# EAGLE design duo (EAGLE 5.06)
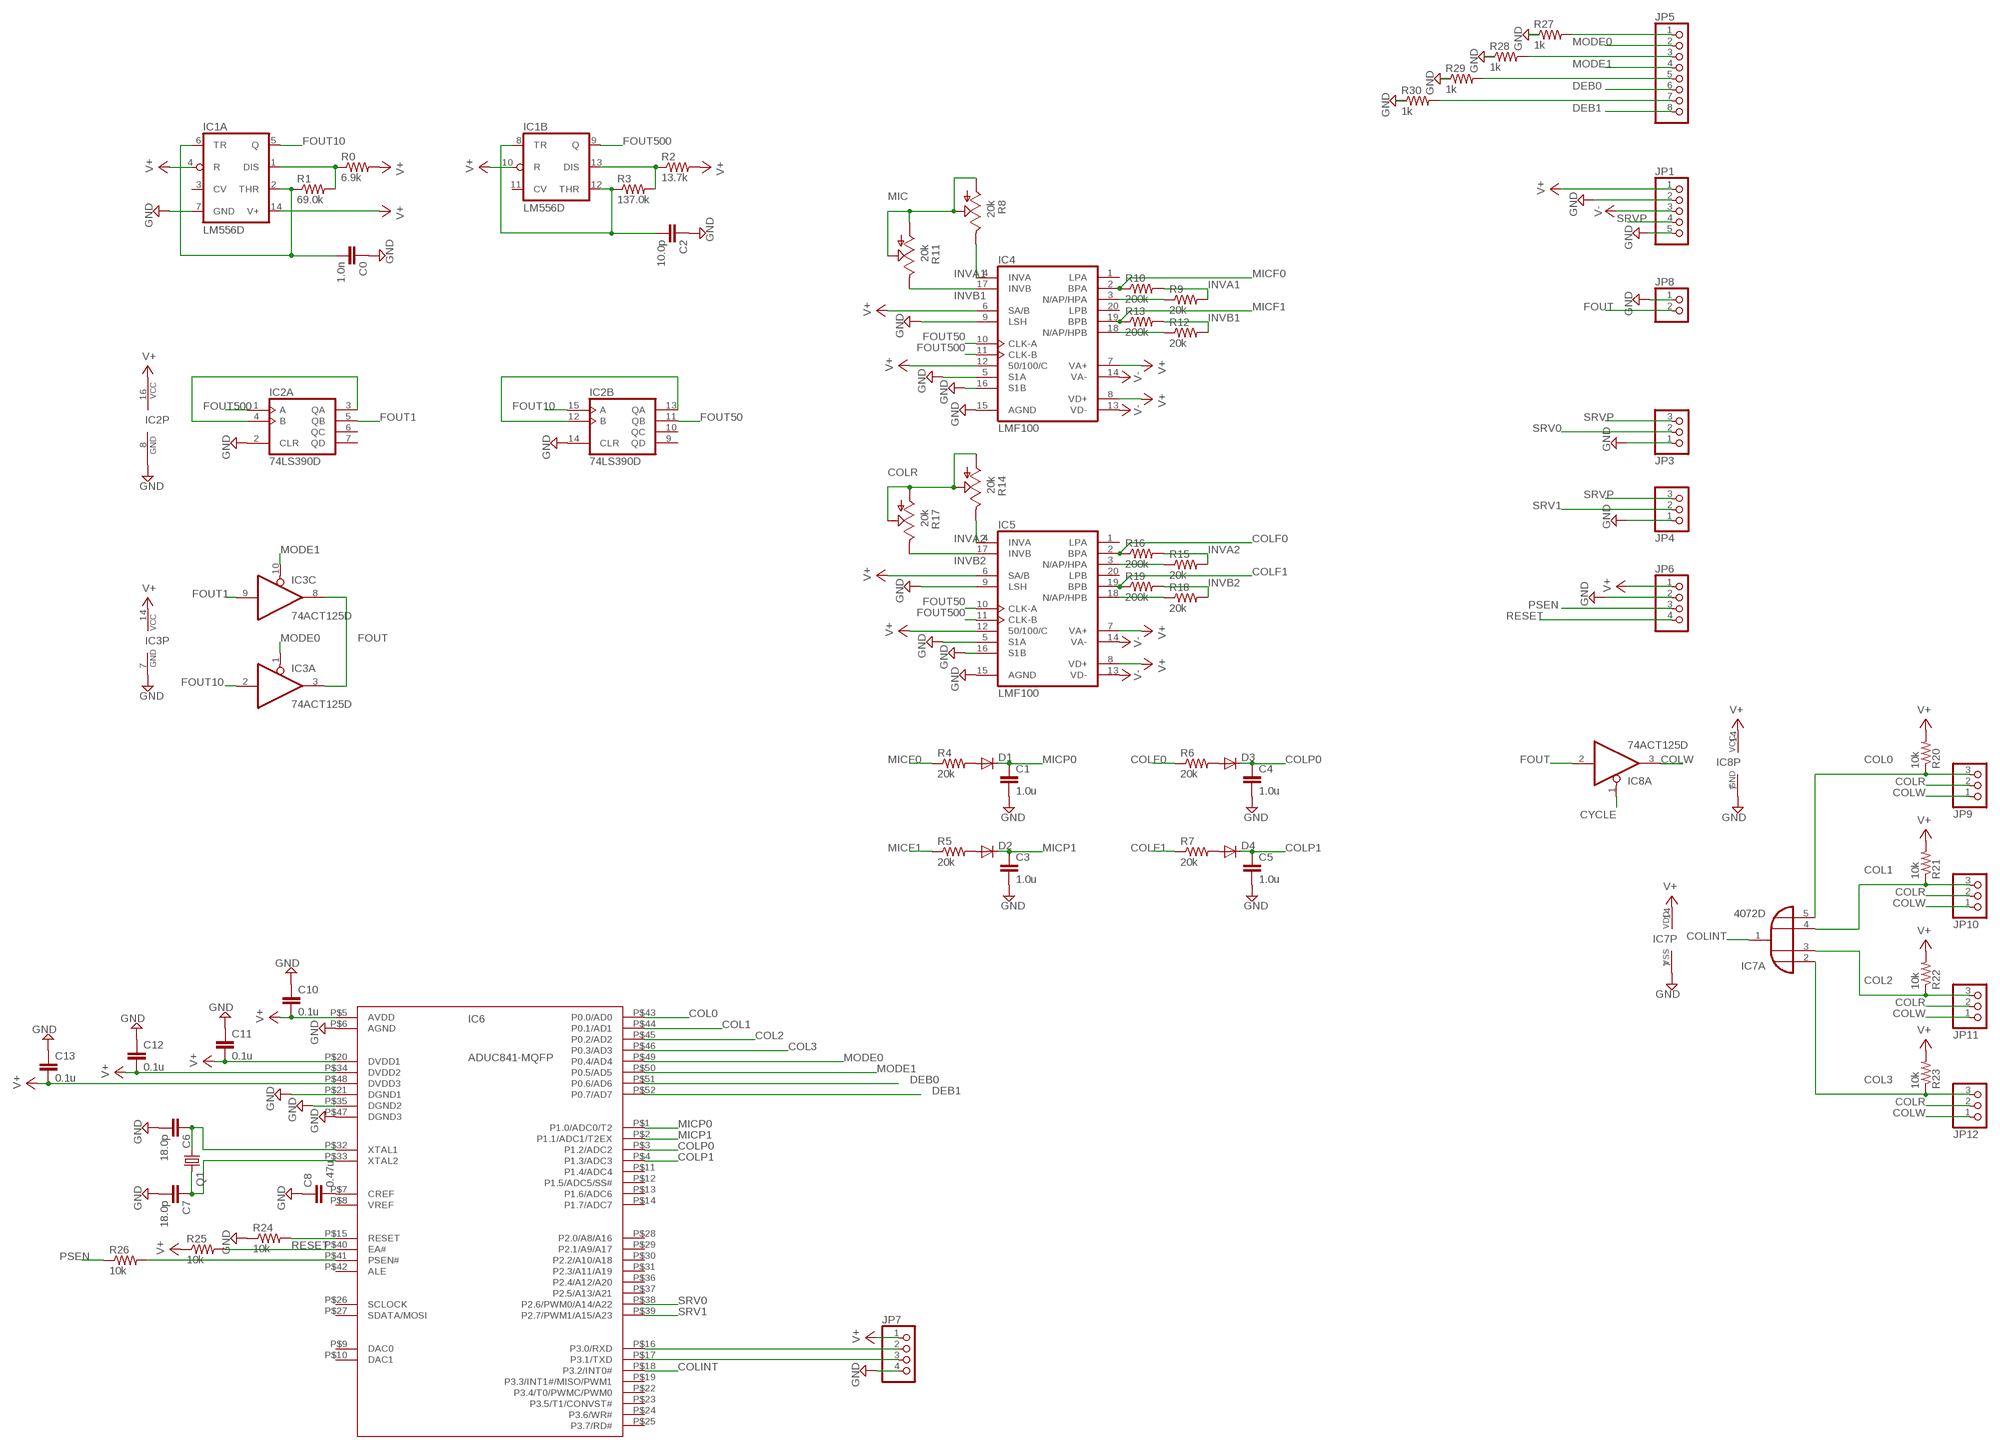
[diagram p0: schematic, sheet 1]

## Parts
C0  1.0n  C-EUC1206  [C1206]
C1  1.0u  C-EUC1206  [C1206]
C2  10.0p  C-EUC1206  [C1206]
C3  1.0u  C-EUC1206  [C1206]
C4  1.0u  C-EUC1206  [C1206]
C5  1.0u  C-EUC1206  [C1206]
C6  18.0p  C-EUC1206  [C1206]
C7  18.0p  C-EUC1206  [C1206]
C8  0.47u  C-EUC1206  [C1206]
C10  0.1u  C-EUC1206  [C1206]
C11  0.1u  C-EUC1206  [C1206]
C12  0.1u  C-EUC1206  [C1206]
C13  0.1u  C-EUC1206  [C1206]
D1  DIODE-DO214AC  [DO214AC]
D2  DIODE-DO214AC  [DO214AC]
D3  DIODE-DO214AC  [DO214AC]
D4  DIODE-DO214AC  [DO214AC]
IC1  LM556D  [SO14]
IC2  74LS390D  [SO16]
IC3  74ACT125D  [SO14]
IC4  LMF100  [SO20W]
IC5  LMF100  [SO20W]
IC6  ADUC841-MQFP  [52-MQFP]
IC7  4072D  [SO14]
IC8  74ACT125D  [SO14]
JP1  PINHD-1X5  [1X05]
JP3  PINHD-1X3  [1X03]
JP4  PINHD-1X3  [1X03]
JP5  PINHD-1X8  [1X08]
JP6  PINHD-1X4  [1X04]
JP7  PINHD-1X4  [1X04]
JP8  PINHD-1X2  [1X02]
JP9  PINHD-1X3  [1X03]
JP10  PINHD-1X3  [1X03]
JP11  PINHD-1X3  [1X03]
JP12  PINHD-1X3  [1X03]
Q1  CRYSTALHC49S  [HC49/S]
R0  6.9k  R-US_R1206  [R1206]
R1  69.0k  R-US_R1206  [R1206]
R2  13.7k  R-US_R1206  [R1206]
R3  137.0k  R-US_R1206  [R1206]
R4  20k  R-US_R1206  [R1206]
R5  20k  R-US_R1206  [R1206]
R6  20k  R-US_R1206  [R1206]
R7  20k  R-US_R1206  [R1206]
R8  20k  TRIM_US-CT6  [CT6]
R9  20k  R-US_R1206  [R1206]
R10  200k  R-US_R1206  [R1206]
R11  20k  TRIM_US-CT6  [CT6]
R12  20k  R-US_R1206  [R1206]
R13  200k  R-US_R1206  [R1206]
R14  20k  TRIM_US-CT6  [CT6]
R15  20k  R-US_R1206  [R1206]
R16  200k  R-US_R1206  [R1206]
R17  20k  TRIM_US-CT6  [CT6]
R18  20k  R-US_R1206  [R1206]
R19  200k  R-US_R1206  [R1206]
R20  10k  R-US_R1206  [R1206]
R21  10k  R-US_R1206  [R1206]
R22  10k  R-US_R1206  [R1206]
R23  10k  R-US_R1206  [R1206]
R24  10k  R-US_R1206  [R1206]
R25  10k  R-US_R1206  [R1206]
R26  10k  R-US_R1206  [R1206]
R27  1k  R-US_R1206  [R1206]
R28  1k  R-US_R1206  [R1206]
R29  1k  R-US_R1206  [R1206]
R30  1k  R-US_R1206  [R1206]

## Nets
COL0: IC6.P$43(P0.0/AD0) IC7.5(A:I3) JP9.3 R20.1
COL1: IC6.P$44(P0.1/AD1) IC7.4(A:I2) JP10.3 R21.1
COL2: IC6.P$45(P0.2/AD2) IC7.3(A:I1) JP11.3 R22.1
COL3: IC6.P$46(P0.3/AD3) IC7.2(A:I0) JP12.3 R23.1
COLF0: IC5.2(BPA) R6.1 R16.1
COLF1: IC5.19(BPB) R7.1 R19.1
COLINT: IC6.P$18(P3.2/INT0#) IC7.1(A:O)
COLP0: C4.1 D3.C IC6.P$3(P1.2/ADC2)
COLP1: C5.1 D4.C IC6.P$4(P1.3/ADC3)
COLR: JP9.2 JP10.2 JP11.2 JP12.2 R14.A R14.S R17.A R17.S
COLW: IC8.3(A:O) JP9.1 JP10.1 JP11.1 JP12.1
CYCLE: IC8.1(A:OE)
DEB0: IC6.P$51(P0.6/AD6) JP5.6
DEB1: IC6.P$52(P0.7/AD7) JP5.8
FOUT: IC3.3(A:O) IC3.8(C:O) IC8.2(A:I) JP8.2
FOUT1: IC2.5(A:QB) IC3.9(C:I)
FOUT10: IC1.5(A:Q) IC2.15(B:A) IC3.2(A:I)
FOUT50: IC2.11(B:QB) IC4.10(CLK-A) IC5.10(CLK-A)
FOUT500: IC1.9(B:Q) IC2.1(A:A) IC4.11(CLK-B) IC5.11(CLK-B)
GND: C0.1 C1.2 C2.1 C3.2 C4.2 C5.2 C6.2 C7.2 C8.1 C10.1 C11.1 C12.1 C13.1 IC1.7(A:GND) IC2.2(A:CLR) IC2.8(P:GND) IC2.14(B:CLR) IC3.7(P:GND) IC4.5(S1A) IC4.9(LSH) IC4.15(AGND) IC4.16(S1B) IC5.5(S1A) IC5.9(LSH) IC5.15(AGND) IC5.16(S1B) IC6.P$6(AGND) IC6.P$21(DGND1) IC6.P$35(DGND2) IC6.P$47(DGND3) IC7.7(P:VSS) IC8.7(P:GND) JP1.2 JP1.5 JP3.1 JP4.1 JP6.2 JP7.4 JP8.1 R24.1 R27.1 R28.1 R29.1 R30.1
INVA1: IC4.4(INVA) R8.E R9.2 R10.2
INVA2: IC5.4(INVA) R14.E R15.2 R16.2
INVB1: IC4.17(INVB) R11.E R12.2 R13.2
INVB2: IC5.17(INVB) R17.E R18.2 R19.2
MIC: R8.A R8.S R11.A R11.S
MICF0: IC4.2(BPA) R4.1 R10.1
MICF1: IC4.19(BPB) R5.1 R13.1
MICP0: C1.1 D1.C IC6.P$1(P1.0/ADC0/T2)
MICP1: C3.1 D2.C IC6.P$2(P1.1/ADC1/T2EX)
MODE0: IC3.1(A:OE) IC6.P$49(P0.4/AD4) JP5.2
MODE1: IC3.10(C:OE) IC6.P$50(P0.5/AD5) JP5.3 R28.2
N$1: IC4.3(N/AP/HPA) R9.1
N$2: D1.A R4.2
N$3: D2.A R5.2
N$4: IC1.1(A:DIS) R0.1 R1.2
N$5: IC4.18(N/AP/HPB) R12.1
N$6: D3.A R6.2
N$7: D4.A R7.2
N$8: IC1.13(B:DIS) R2.1 R3.2
N$9: C2.2 IC1.8(B:TR) IC1.12(B:THR) R3.1
N$10: C0.2 IC1.2(A:THR) IC1.6(A:TR) R1.1
N$11: IC2.3(A:QA) IC2.4(A:B)
N$12: IC2.12(B:B) IC2.13(B:QA)
N$13: C6.1 IC6.P$32(XTAL1) Q1.1
N$14: C7.1 IC6.P$33(XTAL2) Q1.2
N$15: C8.2 IC6.P$7(CREF)
N$16: IC6.P$40(EA#) R25.2
N$17: IC5.3(N/AP/HPA) R15.1
N$18: IC6.P$41(PSEN#) R26.2
N$19: IC5.18(N/AP/HPB) R18.1
N$21: JP5.4
N$22: JP5.5 R29.2
N$24: JP5.7 R30.2
N$26: JP5.1 R27.2
PSEN: JP6.3 R26.1
RESET: IC6.P$15(RESET) JP6.4 R24.2
RXD: IC6.P$16(P3.0/RXD) JP7.2
SRV0: IC6.P$38(P2.6/PWM0/A14/A22) JP3.2
SRV1: IC6.P$39(P2.7/PWM1/A15/A23) JP4.2
SRVP: JP1.4 JP3.3 JP4.3
TXD: IC6.P$17(P3.1/TXD) JP7.3
V+: C10.2 C11.2 C12.2 C13.2 IC1.4(A:R) IC1.10(B:R) IC1.14(A:V+) IC2.16(P:VCC) IC3.14(P:VCC) IC4.6(SA/B) IC4.7(VA+) IC4.8(VD+) IC4.12(50/100/C) IC5.6(SA/B) IC5.7(VA+) IC5.8(VD+) IC5.12(50/100/C) IC6.P$5(AVDD) IC6.P$20(DVDD1) IC6.P$34(DVDD2) IC6.P$48(DVDD3) IC7.14(P:VDD) IC8.14(P:VCC) JP1.1 JP6.1 JP7.1 R0.2 R2.2 R20.2 R21.2 R22.2 R23.2 R25.1
V-: IC4.13(VD-) IC4.14(VA-) IC5.13(VD-) IC5.14(VA-) JP1.3
Unconnected: IC1.3(A:CV) IC1.11(B:CV) IC2.6(A:QC) IC2.7(A:QD) IC2.9(B:QD) IC2.10(B:QC) IC3.4(B:OE) IC3.5(B:I) IC3.6(B:O) IC3.11(D:O) IC3.12(D:I) IC3.13(D:OE) IC4.1(LPA) IC4.20(LPB) IC5.1(LPA) IC5.20(LPB) IC6.P$8(VREF) IC6.P$9(DAC0) IC6.P$10(DAC1) IC6.P$11(P1.4/ADC4) IC6.P$12(P1.5/ADC5/SS#) IC6.P$13(P1.6/ADC6) IC6.P$14(P1.7/ADC7) IC6.P$19(P3.3/INT1#/MISO/PWM1) IC6.P$22(P3.4/T0/PWMC/PWM0) IC6.P$23(P3.5/T1/CONVST#) IC6.P$24(P3.6/WR#) IC6.P$25(P3.7/RD#) IC6.P$26(SCLOCK) IC6.P$27(SDATA/MOSI) IC6.P$28(P2.0/A8/A16) IC6.P$29(P2.1/A9/A17) IC6.P$30(P2.2/A10/A18) IC6.P$31(P2.3/A11/A19) IC6.P$36(P2.4/A12/A20) IC6.P$37(P2.5/A13/A21) IC6.P$42(ALE) IC7.9(B:I0) IC7.10(B:I1) IC7.11(B:I2) IC7.12(B:I3) IC7.13(B:O) IC8.4(B:OE) IC8.5(B:I) IC8.6(B:O) IC8.8(C:O) IC8.9(C:I) IC8.10(C:OE) IC8.11(D:O) IC8.12(D:I) IC8.13(D:OE)

## Library data of the parts
C0 C1-C8 C10-C13 = resistor:C-EU: CAPACITOR, European symbol
D1-D4 = diode:DIODE-: DIODE
IC1 = linear:*556: Dual TIMER
IC2 = 74xx-us:74*390: Dual 4-bit decade and binary COUNTER
IC3 IC8 = 74xx-eu:74*125: Quad bus BUFFER, 3-state
IC4 IC5 = LMF100:LMF100
IC6 = aduc841:ADUC841-MQFP
IC7 = 40xx:4072: Dual 4-input OR
JP1 = pinhead:PINHD-1X5: PIN HEADER
JP3 JP4 JP9-JP12 = pinhead:PINHD-1X3: PIN HEADER
JP5 = pinhead:PINHD-1X8: PIN HEADER
JP6 JP7 = pinhead:PINHD-1X4: PIN HEADER
JP8 = pinhead:PINHD-1X2: PIN HEADER
Q1 = crystal:CRYSTAL: CRYSTAL
R0 R1-R7 R24-R26 = rcl:R-US_: RESISTOR, American symbol
R8 R11 R14 R17 = pot:TRIM_US-: POTENTIOMETER
R9 R10 R12 R13 R15 R16 R18-R23 R27-R30 = resistor:R-US_: RESISTOR, American symbol

## Board
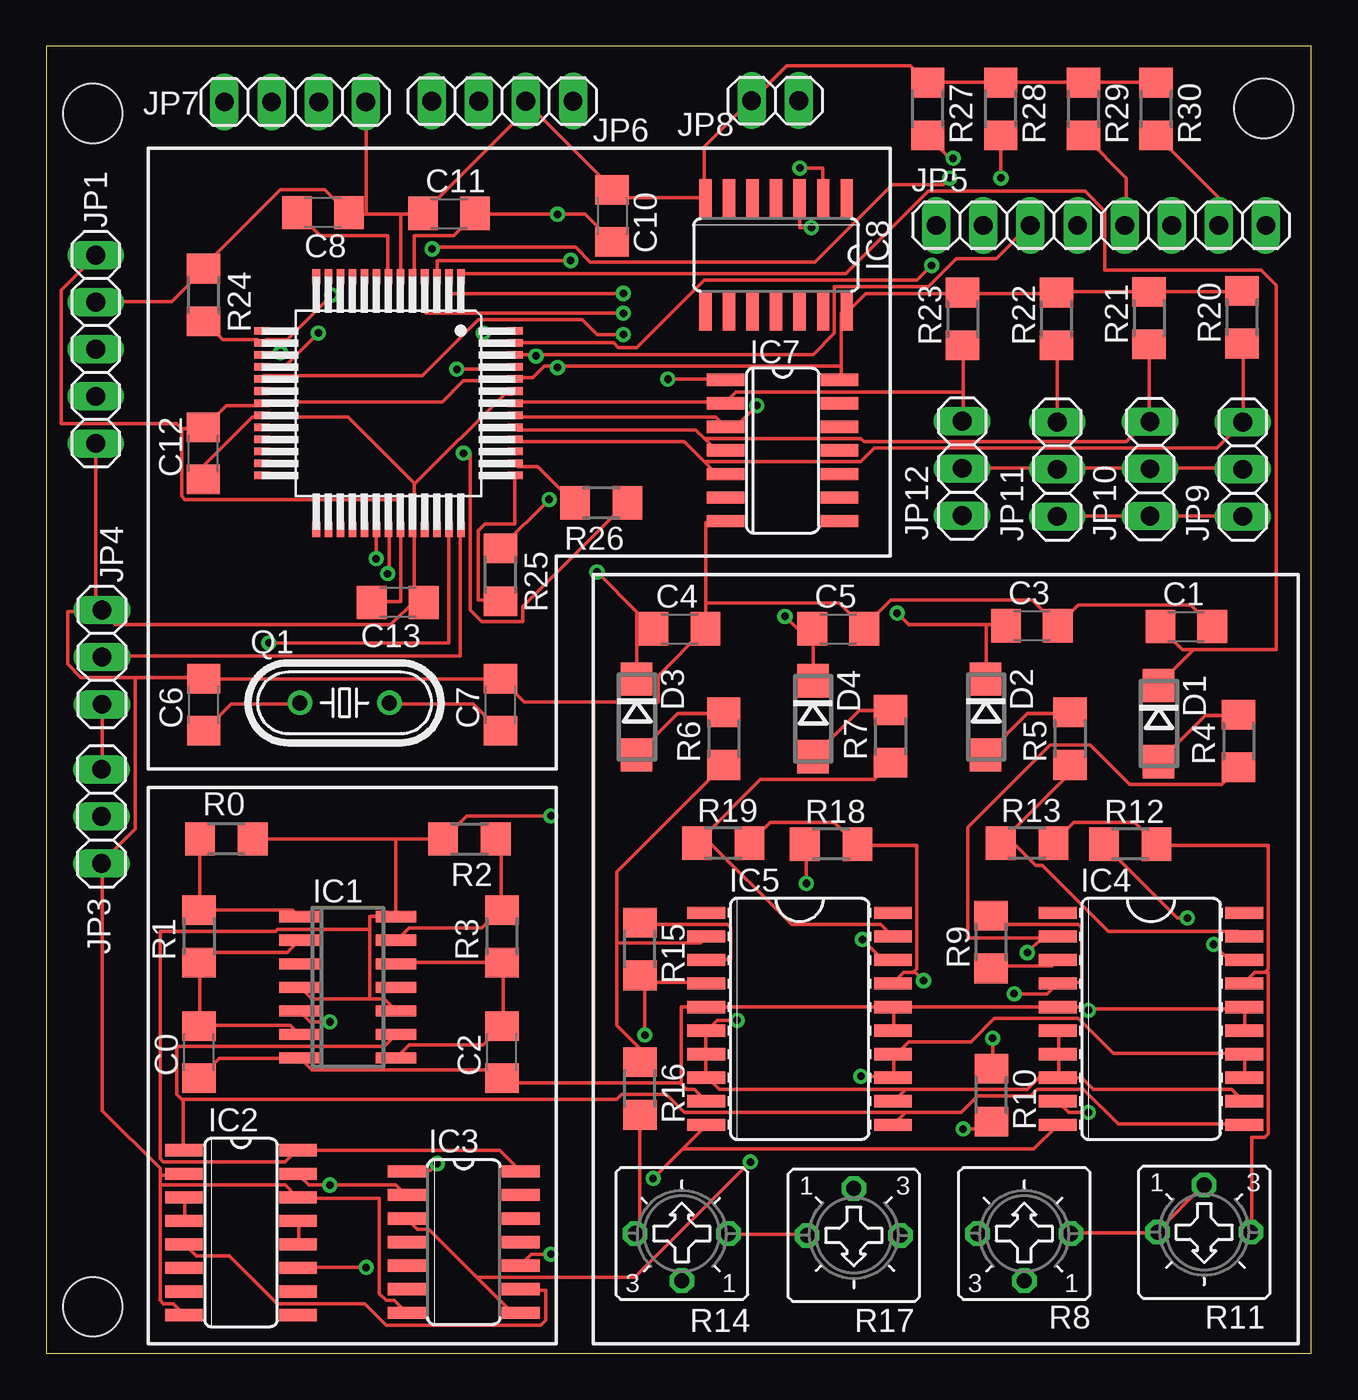
[diagram p1: board, top side]
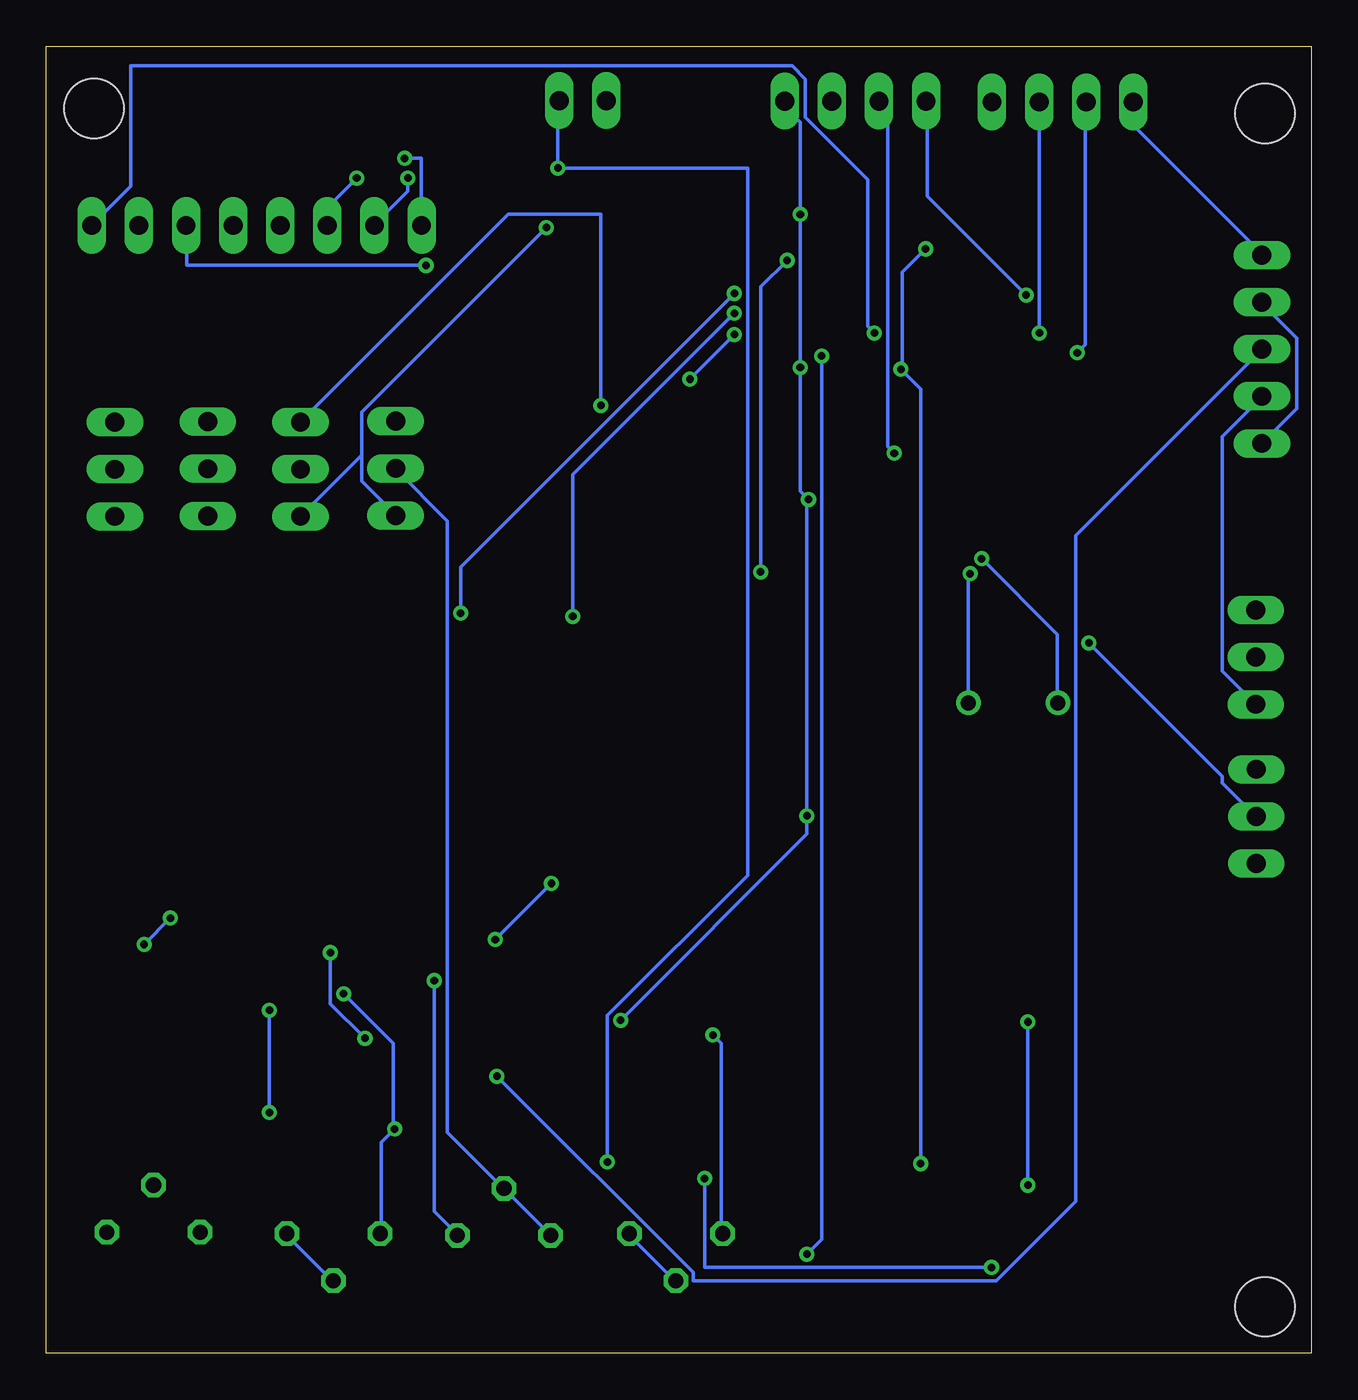
[diagram p2: board, bottom side, seen from below]

Size 68.21 x 70.49 mm. Coordinates in mm from the lower left corner, seen from the top.
Outline: 0,0 68.21,0 68.21,70.49 0,70.49 0,0
Copper layers (1*16): Top 0.0356mm / dielectric 1.5011mm / Bottom 0.0356mm
Design rules "SilverCircuits": minimum track width 7mil, minimum drill 16mil, track to track 7mil, track to pad 7mil, pad to pad 7mil, via to via 7mil, smd to smd 0mil, copper to edge 10mil, drill to drill 8mil, minimum pad ring 10mil, minimum via ring 8mil, stop-mask expansion 4mil, vias tented up to drill 0mil, thermal gap 10mil
Holes 3.2 mm at 2.5,2.5 65.64,67.14 2.5,66.87

### Footprints (pad centres in the part's own frame; a part is rotated, then mirrored left to right if it is on the bottom)
C1206 = smd 1.6 x 1.8: 1 -1.4,0; 2 1.4,0
DO214AC = smd 1.8 x 1.7: A 2.05,0; C -2.05,0
SO14 = smd 0.6 x 2.2: 1 -3.81,-2.6; 2 -2.54,-2.6; 3 -1.27,-2.6; 4 0,-2.6; 5 1.27,-2.6; 6 2.54,-2.6; 7 3.81,-2.6; 8 3.81,2.6; 9 2.54,2.6; 10 1.27,2.6; 11 0,2.6; 12 -1.27,2.6; 13 -2.54,2.6; 14 -3.81,2.6
SO16 = smd 0.66 x 2.032: 1 -4.445,-3.073; 2 -3.175,-3.073; 3 -1.905,-3.073; 4 -0.635,-3.073; 5 0.635,-3.073; 6 1.905,-3.073; 7 3.175,-3.073; 8 4.445,-3.073; 9 4.445,3.073; 10 3.175,3.073; 11 1.905,3.073; 12 0.635,3.073; 13 -0.635,3.073; 14 -1.905,3.073; 15 -3.175,3.073; 16 -4.445,3.073
SO14' = smd 0.66 x 2.032: 1 -3.81,-3.073; 2 -2.54,-3.073; 3 -1.27,-3.073; 4 0,-3.073; 5 1.27,-3.073; 6 2.54,-3.073; 7 3.81,-3.073; 8 3.81,3.073; 9 2.54,3.073; 10 1.27,3.073; 11 0,3.073; 12 -1.27,3.073; 13 -2.54,3.073; 14 -3.81,3.073
SO20W = smd 0.66 x 2.032: 1 -5.715,-5.029; 2 -4.445,-5.029; 3 -3.175,-5.029; 4 -1.905,-5.029; 5 -0.635,-5.029; 6 0.635,-5.029; 7 1.905,-5.029; 8 3.175,-5.029; 9 4.445,-5.029; 10 5.715,-5.029; 11 5.715,5.029; 12 4.445,5.029; 13 3.175,5.029; 14 1.905,5.029; 15 0.635,5.029; 16 -0.635,5.029; 17 -1.905,5.029; 18 -3.175,5.029; 19 -4.445,5.029; 20 -5.715,5.029
52-MQFP = smd 0.406 x 0.813: P$1 0,-2.925; P$2 0.65,-2.925; P$3 1.3,-2.925; P$4 1.95,-2.925; P$5 2.6,-2.925; P$6 3.25,-2.925; P$7 3.9,-2.925; P$8 4.55,-2.925; P$9 5.2,-2.925; P$10 5.85,-2.925; P$11 6.5,-2.925; P$12 7.15,-2.925; P$13 7.8,-2.925; P$27 7.8,10.725; P$28 7.15,10.725; P$29 6.5,10.725; P$30 5.85,10.725; P$31 5.2,10.725; P$32 4.55,10.725; P$33 3.9,10.725; P$34 3.25,10.725; P$35 2.6,10.725; P$36 1.95,10.725; P$37 1.3,10.725; P$38 0.65,10.725; P$39 0,10.725 | smd 0.813 x 0.406: P$14 10.725,0; P$15 10.725,0.65; P$16 10.725,1.3; P$17 10.725,1.95; P$18 10.725,2.6; P$19 10.725,3.25; P$20 10.725,3.9; P$21 10.725,4.55; P$22 10.725,5.2; P$23 10.725,5.85; P$24 10.725,6.5; P$25 10.725,7.15; P$26 10.725,7.8; P$40 -2.925,7.8; P$41 -2.925,7.15; P$42 -2.925,6.5; P$43 -2.925,5.85; P$44 -2.925,5.2; P$45 -2.925,4.55; P$46 -2.925,3.9; P$47 -2.925,3.25; P$48 -2.925,2.6; P$49 -2.925,1.95; P$50 -2.925,1.3; P$51 -2.925,0.65; P$52 -2.925,0
1X05 = drill 1.016 long: 1 -5.08,0; 2 -2.54,0; 3 0,0; 4 2.54,0; 5 5.08,0
1X03 = drill 1.016 long: 1 -2.54,0; 2 0,0; 3 2.54,0
1X08 = drill 1.016 long: 1 -8.89,0; 2 -6.35,0; 3 -3.81,0; 4 -1.27,0; 5 1.27,0; 6 3.81,0; 7 6.35,0; 8 8.89,0
1X04 = drill 1.016 long: 1 -3.81,0; 2 -1.27,0; 3 1.27,0; 4 3.81,0
1X02 = drill 1.016 long: 1 -1.27,0; 2 1.27,0
HC49/S = drill 0.813 round: 1 -2.413,0; 2 2.413,0
R1206 = smd 1.6 x 1.803: 1 -1.422,0; 2 1.422,0
CT6 = drill 0.813 octagon: A 2.515,0; E -2.515,0; S 0,-2.54

### Placement (x,y rotation side)
C0  8.23,16.23 90 top
C1  61.47,39.19 0 top
C2  24.56,16.23 90 top
C3  53.14,39.24 0 top
C4  34.14,39.07 0 top
C5  42.7,39.07 0 top
C6  8.48,34.98 90 top
C7  24.49,34.98 90 top
C8  14.91,61.52 180 top
C10  30.51,61.34 270 top
C11  21.72,61.47 0 top
C12  8.46,48.54 90 top
C13  18.95,40.49 180 top
D1  59.97,33.96 270 top
D2  50.65,34.32 270 top
D3  31.83,34.32 270 top
D4  41.33,34.21 270 top
IC1  16.26,19.74 270 top
IC2  10.49,6.5 270 top
IC3  74ACT125D  [SO14']  22.5,5.99 270 top
IC4  59.56,18.03 270 top
IC5  40.61,18.03 270 top
IC6  22.35,55.14 180 top
IC7  4072D  [SO14']  39.7,48.69 270 top
IC8  74ACT125D  [SO14']  39.34,59.23 180 top
JP1  2.67,54.15 270 top
JP3  2.97,28.96 90 top
JP4  3,37.54 270 top
JP5  56.87,60.83 0 top
JP6  24.59,67.54 180 top
JP7  13.41,67.49 0 top
JP8  39.29,67.56 0 top
JP9  64.52,47.68 90 top
JP10  59.51,47.7 90 top
JP11  54.51,47.68 90 top
JP12  49.38,47.73 90 top
Q1  16.08,35.08 0 top
R0  9.7,27.74 0 top
R1  8.23,22.48 90 top
R2  22.81,27.74 180 top
R3  24.56,22.48 90 top
R4  64.29,33.02 90 top
R5  55.19,33.15 90 top
R6  36.53,33.15 90 top
R7  45.52,33.27 90 top
R8  52.73,6.45 0 top
R9  50.93,22.17 90 top
R10  50.95,13.92 270 top
R11  62.43,6.53 180 top
R12  58.45,27.46 0 top
R13  52.88,27.51 0 top
R14  34.26,6.45 0 top
R15  32,21.79 270 top
R16  32,14.27 270 top
R17  43.54,6.35 180 top
R18  42.32,27.46 0 top
R19  36.5,27.51 0 top
R20  64.47,55.88 90 top
R21  59.46,55.83 90 top
R22  54.46,55.78 90 top
R23  49.4,55.78 90 top
R24  8.48,57.07 270 top
R25  24.49,41.99 270 top
R26  29.92,45.87 180 top
R27  47.52,67.11 270 top
R28  51.46,67.11 270 top
R29  55.93,67.11 270 top
R30  59.84,67.11 270 top

### Tracks (layer width: path | path; a pad name or v marks a point on that pad's centre or on a via)
COL0
  Top 0.178: R20.1 64.54,54.41 64.54,50.23 JP9.3 64.45,50.14 63.12,48.81 44.63,48.81 43.92,48.09 35.56,48.09 35.52,48.05 | 35.52,48.05 36.09,47.47 36.63,47.47 IC7.5 | 35.52,48.05 34.4,49.16 25.43,49.16 25.34,49.25 IC6.P$43
COL1
  Top 0.178: R21.1 59.47,54.41 59.47,50.32 JP10.3 59.38,50.32 58.23,49.16 44.09,49.16 43.92,49.34 35.56,49.34 35.52,49.3 | 35.52,49.3 36.09,48.72 36.63,48.72 IC7.4 | 35.52,49.3 35.03,49.78 25.43,49.78 25.34,49.87 IC6.P$44
COL2  (via drill 0.41)
  Top 0.178: R22.1 54.5,54.32 54.5,50.23 JP11.3 | IC6.P$45 25.34,50.58 25.43,50.49 36.09,50.49 IC7.3 36.63,50.05 37.25,50.05 v38.32,51.12
  Bottom 0.178: v38.32,51.12 38.32,61.43 43.29,61.43 JP11.3
COL3
  Top 0.178: 49.43,51.83 49.43,50.32 JP12.3 | 49.43,51.83 49.43,54.32 R23.1 | 36.63,51.3 25.34,51.3 IC6.P$46 | 49.43,51.83 37.16,51.83 36.63,51.3 | 36.63,51.3 IC7.2
COLF0
  Top 0.178: 30.76,22.14 30.76,17.69 32,16.45 R16.1 | 30.76,22.14 35.29,22.14 35.56,22.4 IC5.2 | 30.76,22.14 30.76,25.96 36.45,31.65 R6.1
COLF1
  Top 0.178: R7.1 45.52,31.83 44.63,30.94 38.49,30.94 35.12,27.56 R19.1 35.47,27.83 40.18,23.11 44.98,23.11 45.61,22.49 IC5.19
COLINT  (via drill 0.41)
  Top 0.178: v31.11,54.94 29.69,54.94 28.89,55.74 23.29,55.74 20.27,52.72 11.73,52.72 11.65,52.63 IC6.P$18 | v33.52,52.54 36.63,52.54 IC7.1
  Bottom 0.178: v31.11,54.94 v33.52,52.54
COLP0  (via drill 0.41)
  Top 0.178: v28.27,58.94 21.07,58.94 21.07,58.14 IC6.P$3 | 31.87,39.96 32.72,39.12 C4.1 | 31.87,39.96 v29.69,42.14 | D3.C 31.83,39.92 31.87,39.96
  Bottom 0.178: v28.27,58.94 29.69,57.52 v29.69,42.14
COLP1  (via drill 0.41)
  Top 0.178: v31.11,56.1 20.45,56.1 20.45,58.05 IC6.P$4 | v39.83,39.74 40.45,39.12 41.25,39.12 C5.1 41.34,39.03 41.34,36.27 D4.C
  Bottom 0.178: v31.11,56.1 39.83,47.38 v39.83,39.74
COLR
  Top 0.178: R14.A 36.8,6.4 40.98,6.4 R17.A | JP9.2 64.45,47.74 59.56,47.74 JP10.2 59.47,47.74 54.59,47.74 JP11.2 54.5,47.74 49.43,47.74 JP12.2
  Bottom 0.178: R14.S 34.31,3.91 36.72,6.31 36.72,6.4 R14.A | R17.A 43.47,8.8 43.47,8.89 R17.S 43.56,8.89 46.58,11.91 46.58,44.9 49.34,47.65 JP12.2
COLW  (via drill 0.41)
  Top 0.178: JP11.1 54.59,45.16 JP10.1 64.45,45.16 JP9.1 | v41.25,60.72 40.63,60.72 40.63,62.23 IC8.3
  Bottom 0.178: v41.25,60.72 51.21,50.76 51.21,48.45 | 51.21,48.45 51.21,47.03 49.43,45.25 JP12.1 | 51.21,48.45 54.5,45.16 JP11.1
DEB0  (via drill 0.41)
  Top 0.178: v47.74,58.67 46.94,57.87 35.47,57.87 31.83,54.23 30.85,54.23 30.58,54.5 25.34,54.5 IC6.P$51
  Bottom 0.178: v47.74,58.67 60.63,58.67 60.63,60.81 JP5.6
DEB1  (via drill 0.41)
  Top 0.178: v23.56,55.03 25.16,55.03 25.25,55.12 IC6.P$52
  Bottom 0.178: v23.56,55.03 23.91,55.38 23.91,63.3 27.29,66.67 27.29,68.72 28,69.43 63.65,69.43 63.65,62.94 JP5.8
FOUT  (via drill 0.41)
  Top 0.178: v40.63,63.92 41.87,63.92 IC8.2 | 23.25,4.04 25.07,2.22 25.51,2.22 IC3.8 | 23.25,4.04 20.62,6.67 20,6.67 19.47,7.2 IC3.3 | v37.96,10.31 31.74,4.09 23.29,4.09 23.25,4.04
  Bottom 0.178: JP8.2 40.63,67.56 v40.63,63.92 30.4,63.92 30.4,25.78 37.96,18.22 v37.96,10.31
FOUT1
  Top 0.178: IC2.5 7.47,5.87 8.09,5.25 9.87,5.25 12.45,2.67 17.16,2.67 18.31,1.51 26.67,1.51 26.94,1.78 26.94,3.38 25.6,3.38 IC3.9
FOUT10  (via drill 0.41)
  Top 0.178: IC2.15 13.6,9.6 14.13,9.07 v15.29,9.07 18.85,9.07 19.38,8.53 IC3.2 | v15.29,17.87 14.22,17.87 13.69,18.4 IC1.5
  Bottom 0.178: v15.29,9.07 v15.29,17.87
FOUT50  (via drill 0.41)
  Top 0.178: v17.25,4.62 13.6,4.62 IC2.11 | 34.36,11.07 35.56,12.27 IC5.10 | v32.72,9.42 34.36,11.07 | IC4.10 54.5,12.27 53.25,11.02 34.4,11.02 34.36,11.07
  Bottom 0.178: v17.25,4.62 32.72,4.62 v32.72,9.42
FOUT500
  Top 0.178: 7.38,13.69 7.38,11.02 IC2.1 | 7.38,13.69 7.29,13.69 7.02,13.96 7.02,16.54 18.22,16.54 18.85,17.16 IC1.9 | 46.27,12.94 46.32,12.98 49.34,12.98 50.23,13.87 53.07,13.87 53.43,14.22 55.92,14.22 57.78,12.36 64.54,12.36 IC4.11 | 46.27,12.94 45.7,12.36 IC5.11 | 7.38,13.69 30.76,13.69 31.03,13.96 33.43,13.96 34.4,12.98 46.23,12.98 46.27,12.94
GND  (via drill 0.41)
  Top 0.178: C0.1 8.27,14.85 9.34,15.91 13.6,15.91 IC1.7 13.69,15.91 14.31,15.29 24.09,15.29 24.54,14.85 C2.1 24.62,14.76 24.8,14.58 29.52,14.58 | 34.23,14.58 34.23,18.67 IC5.5 IC5.16 45.7,18.67 | 34.23,14.58 34.23,14.49 34.49,14.22 34.94,14.22 35.56,13.6 IC5.9 | IC4.15 64.63,17.42 64.63,18.67 IC4.16 64.54,18.67 64.45,18.58 56.19,18.58 v56.19,18.49 56.01,18.67 IC4.5 45.7,18.67 | 45.7,18.67 45.7,17.42 IC5.15 | v56.19,12.98 55.12,12.98 54.59,13.51 IC4.9 | 29.52,14.58 34.23,14.58 | 19.11,61.43 19.11,58.14 IC6.P$6 | 19.11,61.43 20.27,61.43 C11.1 20.36,61.52 26.05,67.21 JP6.2 25.87,67.47 30.58,62.76 C10.1 30.58,62.67 30.94,62.32 35.47,62.32 IC8.7 35.47,62.41 35.47,65.08 37.96,67.56 JP8.1 38.05,67.56 39.92,69.43 46.58,69.43 47.47,68.54 R27.1 47.56,68.54 51.38,68.54 R28.1 51.47,68.54 55.92,68.54 R29.1 56.01,68.54 59.83,68.54 R30.1 | 17.25,61.43 19.11,61.43 | 17.25,61.43 16.45,61.43 16.36,61.52 C8.1 16.27,61.52 15.02,62.76 12.62,62.76 8.53,58.67 8.53,58.5 R24.1 8.45,58.41 6.76,56.72 2.67,56.72 JP1.2 | 17.25,61.43 17.25,67.47 JP7.4 | C1.2 62.85,39.2 61.7,40.36 55.65,40.36 54.59,39.29 C3.2 54.5,39.29 53.16,40.63 45.52,40.63 44.09,39.2 C5.2 44.09,39.12 42.76,40.45 35.56,40.45 | 35.56,40.45 35.56,44.81 36.63,44.81 IC7.7 | 35.56,40.45 35.56,39.12 C4.2 35.47,39.03 32.98,36.54 32.98,35.12 29.52,35.12 | C12.1 8.53,47.21 8.53,47.92 11.11,50.49 11.47,50.49 11.56,50.58 IC6.P$21 11.65,50.58 11.73,50.49 16.27,50.49 19.82,46.94 19.87,46.9 | 19.82,40.54 19.82,44.36 IC6.P$35 19.82,44.45 19.82,46.85 19.87,46.9 | 19.82,40.54 20.27,40.54 C13.1 19.82,40.54 | 19.87,46.9 24.71,51.74 25.16,51.74 25.25,51.83 IC6.P$47
  Top 0.178: 6.13,9.07 6.13,9.6 | 6.13,9.07 6.13,2.85 6.31,2.67 6.84,2.67 7.38,2.13 IC2.8 | 6.13,9.6 7.38,9.6 IC2.2 | 6.13,9.07 12.89,9.07 13.51,8.45 IC2.14 13.6,8.36 17.96,8.36 17.96,3.2 18.31,2.85 18.76,2.85 19.38,2.22 IC3.7 | 4.8,36.45 1.87,36.45 1.16,37.16 1.16,40.01 2.67,40.01 | 4.8,36.45 8.45,36.45 C6.2 8.53,36.36 24.45,36.36 C7.2 24.54,36.36 25.78,35.12 29.52,35.12 | 2.67,40.01 2.93,40.01 JP4.1 | 4.8,36.45 4.8,28.27 3.02,26.49 JP3.1 3.02,26.4 3.02,13.07 6.13,9.96 6.13,9.6 | 2.67,40.01 JP1.5 | 2.67,40.01 JP4.1 | 19.82,40.54 18.58,39.29 3.73,39.29 3.02,40.01 JP4.1 | 29.52,35.12 29.52,14.58
  Bottom 0.178: v56.19,18.49 v56.19,12.98 | JP1.5 0.8,50.94 0.8,54.76 2.67,56.63 JP1.2
INVA1  (via drill 0.41)
  Top 0.178: R9.2 50.94,23.56 51.38,23.11 55.65,23.11 55.83,22.94 55.83,20 54.59,20 IC4.4 54.5,19.91 53.96,19.38 v52.18,19.38 | v49.43,12.09 50.58,12.09 50.94,12.45 R10.2
  Bottom 0.178: R8.E 50.14,6.49 50.14,11.38 v49.43,12.09 49.52,12.09 49.52,16.71 v52.18,19.38
INVA2  (via drill 0.41)
  Top 0.178: IC5.4 35.56,20 32.36,20 32,20.36 R15.2 32.27,20 v32.27,17.16 | R16.2 32,6.49 31.83,6.49 R14.E
  Bottom 0.178: v32.27,17.16 31.83,16.71 31.83,6.49 R14.E
INVB1
  Top 0.178: R13.2 54.32,27.56 55.38,28.63 58.67,28.63 59.83,27.47 R12.2 59.92,27.38 65.88,27.38 65.88,20.71 65.74,20.58 | 65.74,20.58 65.7,20.54 65.16,20.54 64.63,20 IC4.17 | R11.E 64.99,6.58 64.99,11.65 65.7,11.65 65.88,11.82 65.88,20.54 65.79,20.54 65.74,20.58
INVB2  (via drill 0.41)
  Top 0.178: R19.2 37.96,27.56 39.03,28.63 42.49,28.63 43.65,27.47 R18.2 43.74,27.38 46.94,27.38 46.94,20.71 46.81,20.58 | 46.81,20.58 46.76,20.54 46.23,20.54 45.7,20 IC5.17 | v47.3,20.09 46.85,20.54 46.81,20.58
  Bottom 0.178: v47.3,20.09 47.3,7.64 46.05,6.4 R17.E
MIC
  Top 0.178: R11.S 62.41,9.07 59.92,6.58 R11.A 59.92,6.49 55.3,6.49 R8.A
  Bottom 0.178: R8.S 52.81,3.91 55.21,6.31 55.21,6.4 R8.A
MICF0  (via drill 0.41)
  Top 0.178: v51.03,16.98 51.03,15.38 R10.1 | v52.9,21.6 53.7,22.4 54.5,22.4 IC4.2 53.61,22.4 49.7,22.4 49.7,28.36 54.14,32.8 56.27,32.8 58.41,30.67 63.39,30.67 64.28,31.56 R4.1
  Bottom 0.178: v51.03,16.98 52.9,18.85 v52.9,21.6
MICF1
  Top 0.178: R5.1 55.12,31.65 55.12,31.2 51.47,27.56 R13.1 51.83,27.83 53.34,26.31 53.7,26.31 57.25,22.76 64.28,22.76 64.54,22.49 IC4.19
MICP0
  Top 0.178: 61.87,37.96 61.25,37.96 60.1,39.12 C1.1 | 61.87,37.96 66.32,37.96 66.32,57.61 65.52,58.41 57.07,58.41 57.07,61.61 56.01,62.67 47.56,62.67 43.12,58.23 22.49,58.23 22.4,58.14 IC6.P$1 | 61.87,37.96 60.01,36.09 D1.C
MICP1  (via drill 0.41)
  Top 0.178: v31.11,57.16 21.78,57.16 21.78,58.05 IC6.P$2 | v45.87,39.92 46.49,39.29 50.67,39.29 | 50.67,39.29 51.65,39.29 C3.1 | 50.67,39.29 50.67,36.45 D2.C
  Bottom 0.178: v31.11,57.16 45.87,42.41 v45.87,39.92
MODE0  (via drill 0.41)
  Top 0.178: v22.14,53.07 25.16,53.07 25.25,53.16 IC6.P$49 | v21.07,10.22 20.71,9.87 19.47,9.87 IC3.1 | v48.72,63.39 48.36,63.03 45.61,63.03 41.43,58.85 29.34,58.85 28.54,59.65 20.89,59.65 v20.8,59.56
  Bottom 0.178: v21.07,10.22 21.07,52.01 v22.14,53.07 22.05,53.07 22.05,58.32 v20.8,59.56 | v48.72,63.39 48.72,62.67 50.49,60.9 JP5.2
MODE1  (via drill 0.41)
  Top 0.178: 26.4,53.87 41.34,53.87 42.49,55.03 42.49,57.52 47.56,57.52 49.07,59.03 51.21,59.03 52.98,60.81 JP5.3 | 26.4,53.87 25.34,53.87 IC6.P$50 | v51.47,63.39 51.47,65.61 R28.2 | v27.2,5.33 26.14,5.33 25.6,4.8 IC3.10 | v26.4,53.78 26.4,53.87
  Bottom 0.178: v51.47,63.39 52.98,61.87 52.98,60.9 JP5.3 | v27.2,5.33 26.4,6.13 v26.4,53.78
N$1
  Top 0.178: R9.1 50.94,20.8 51.03,20.89 54.23,20.89 54.5,21.16 IC4.3
N$2
  Top 0.178: D1.A 60.01,31.91 62.5,34.4 64.28,34.4 R4.2
N$3
  Top 0.178: D2.A 50.67,32.27 52.9,34.49 55.12,34.49 R5.2
N$4
  Top 0.178: R0.1 8.27,27.74 8.27,23.91 R1.2 8.36,23.91 13.25,23.91 13.6,23.56 IC1.1
N$5  (via drill 0.41)
  Top 0.178: v61.52,23.47 60.98,23.47 57.07,27.38 R12.1 | v62.94,22.05 63.74,21.25 64.54,21.25 IC4.18
  Bottom 0.178: v61.52,23.47 v62.94,22.05
N$6
  Top 0.178: D3.A 34.05,34.49 36.45,34.49 R6.2
N$7
  Top 0.178: D4.A 41.34,32.18 43.83,34.67 45.52,34.67 R7.2
N$8
  Top 0.178: R2.1 24.54,27.74 24.54,23.91 R3.2 24.45,23.91 23.47,22.94 19.56,22.94 18.94,22.31 IC1.13
N$9
  Top 0.178: IC1.8 18.94,16 19.56,16.62 23.56,16.62 24.54,17.6 C2.2 24.62,17.69 24.62,20.98 R3.1 24.54,21.07 18.94,21.07 IC1.12
N$10
  Top 0.178: IC1.6 13.6,17.25 13.16,17.69 8.36,17.69 C0.2 8.27,17.69 8.27,20.98 R1.1 8.36,20.98 8.98,21.6 12.98,21.6 13.6,22.23 IC1.2
N$11
  Top 0.178: IC2.4 7.47,7.2 7.47,8.36 IC2.3
N$12
  Top 0.178: IC2.12 13.6,5.87 13.6,7.11 IC2.13
N$13  (via drill 0.41)
  Top 0.178: v17.78,42.85 17.78,44.36 IC6.P$32 | C6.1 8.53,33.6 9.96,35.03 13.6,35.03 Q1.1
  Bottom 0.178: v17.78,42.85 13.69,38.76 13.69,35.12 Q1.1
N$14  (via drill 0.41)
  Top 0.178: v18.4,42.05 18.49,42.05 18.49,44.36 IC6.P$33 | C7.1 24.45,33.6 23.02,35.03 18.49,35.03 Q1.2
  Bottom 0.178: v18.4,42.05 18.49,41.96 Q1.2
N$15
  Top 0.178: IC6.P$7 18.4,58.14 18.4,60.27 14.76,60.27 C8.2
N$16
  Top 0.178: IC6.P$40 25.25,47.3 25.25,44.72 23.65,44.72 23.29,44.36 23.29,40.63 24.45,40.63 R25.2
N$17
  Top 0.178: R15.1 32,23.2 32.09,23.11 36.72,23.11 36.89,22.94 36.89,21.25 35.65,21.25 IC5.3
N$18
  Top 0.178: IC6.P$41 25.34,47.92 25.43,47.83 26.49,47.83 28.45,45.87 R26.2
N$19  (via drill 0.41)
  Top 0.178: v40.98,25.34 40.98,27.38 R18.1 | v44.01,22.31 45.07,21.25 45.61,21.25 IC5.18
  Bottom 0.178: v44.01,22.31 v40.98,25.34
N$22
  Top 0.178: R29.2 56.01,65.61 58.23,63.39 58.23,60.9 58.14,60.9 JP5.5
N$24
  Top 0.178: R30.2 59.92,65.61 63.21,62.32 63.21,60.9 JP5.7
N$26  (via drill 0.41)
  Top 0.178: v48.9,64.45 48.72,64.45 47.56,65.61 R27.2
  Bottom 0.178: v48.9,64.45 48.01,64.45 48.01,60.9 JP5.1
PSEN  (via drill 0.41)
  Top 0.178: v22.49,48.54 22.85,48.54 22.85,40.09 23.47,39.47 25.69,39.47 25.69,40.27 31.29,45.87 R26.1
  Bottom 0.178: v22.49,48.54 22.85,48.9 22.85,67.03 23.29,67.47 JP6.3
RESET  (via drill 0.41)
  Top 0.178: R24.2 8.53,55.65 9.51,54.67 11.38,54.67 11.56,54.5 IC6.P$15 11.65,54.5 11.82,54.67 12.98,54.67 v15.38,57.07
  Bottom 0.178: v15.38,57.07 20.71,62.41 20.71,67.47 JP6.4
RXD  (via drill 0.41)
  Top 0.178: v12.62,53.96 11.73,53.96 11.65,53.87 IC6.P$16
  Bottom 0.178: v12.62,53.96 12.18,54.41 12.18,67.47 JP7.2
SRV0  (via drill 0.41)
  Top 0.178: v12,38.32 21.69,38.32 21.69,44.36 IC6.P$38
  Bottom 0.178: v12,38.32 4.8,31.11 4.8,30.76 3.02,28.98 JP3.2
SRV1
  Top 0.178: IC6.P$39 22.31,44.36 22.31,37.6 3.02,37.6 JP4.2
SRVP
  Top 0.178: JP3.3 3.02,31.56 3.02,34.94 JP4.3
  Bottom 0.178: JP1.4 2.67,51.56 4.8,49.43 4.8,36.8 JP4.3
TXD  (via drill 0.41)
  Top 0.178: v14.67,55.03 12.89,53.25 11.65,53.25 IC6.P$17
  Bottom 0.178: v14.67,55.03 14.67,67.47 JP7.3
V+  (via drill 0.41)
  Top 0.178: 42.85,53.25 42.85,56.1 43.12,56.1 IC8.14 43.2,56.19 44.18,57.16 49.34,57.16 R23.2 49.43,57.16 54.41,57.16 R22.2 54.5,57.25 59.38,57.25 R21.2 59.47,57.25 64.45,57.25 R20.2 | 42.85,53.25 42.85,52.54 IC7.14 | C13.2 17.6,40.54 19.11,40.54 19.11,44.36 IC6.P$34 19.02,44.45 19.02,46.05 7.47,46.05 7.29,46.23 7.29,49.87 | 7.29,49.87 8.45,49.87 C12.2 8.53,49.96 9.69,51.12 11.47,51.12 11.56,51.21 IC6.P$20 11.65,51.3 21.34,51.3 22.49,52.45 25.16,52.45 25.25,52.54 IC6.P$48 25.34,52.63 26.23,52.63 26.85,53.25 27.56,53.25 | 7.29,49.87 7.02,50.14 0.8,50.14 0.8,57.34 2.67,59.21 JP1.1 | 27.56,53.25 42.85,53.25 | IC3.14 24.45,10.94 13.6,10.94 IC2.16 13.51,10.94 12.89,10.31 6.31,10.31 6.13,10.49 6.13,22.76 12.36,22.76 12.45,22.85 17.42,22.85 | 17.42,19.11 18.22,19.11 18.85,18.49 IC1.10 | 17.42,19.11 14.31,19.11 13.69,19.74 IC1.4 | 18.85,27.74 R0.2 | 18.85,27.74 R2.2 21.43,27.74 22.67,28.98 v27.2,28.98 | 18.85,27.74 18.85,23.56 IC1.14 18.76,23.56 17.42,23.56 17.42,22.85 | 17.42,22.85 17.42,19.11 | IC4.6 54.59,17.34 54.59,16.18 IC4.7 54.59,16.09 54.59,14.94 IC4.8 | 46.27,14.18 46.32,14.22 52.9,14.22 53.52,14.85 54.5,14.85 IC4.8 | 46.27,14.18 45.7,13.6 IC5.12 | IC4.12 64.54,13.6 63.92,14.22 56.45,14.22 55.83,14.85 54.59,14.85 IC4.8 | 46.27,14.18 46.23,14.22 36.27,14.22 35.65,14.85 IC5.8 35.56,14.94 35.56,16.09 IC5.7 35.56,16.18 35.56,17.34 IC5.6 35.65,17.42 36.18,17.96 v37.25,17.96 | IC6.P$5 19.82,58.14 19.82,60.27 21.96,60.27 23.11,61.43 C11.2 23.2,61.43 v27.56,61.43 29.07,61.43 30.49,60.01 C10.2 | v27.11,46.05 24.54,43.47 R25.1 | v27.56,53.16 27.56,53.25
  Bottom 0.178: JP1.1 2.67,59.3 9.6,66.23 JP7.1 | JP6.1 28.36,67.47 28.36,67.21 27.56,66.41 v27.56,61.43 v27.56,53.16 27.56,46.49 v27.11,46.05 27.2,46.05 v27.2,28.98 27.2,28 v37.25,17.96
V-  (via drill 0.41)
  Top 0.178: IC4.13 64.63,14.94 64.63,16.09 IC4.14 64.54,16.18 57.52,16.18 55.65,18.05 51.12,18.05 49.87,16.8 46.49,16.8 45.78,16.09 IC5.14 45.7,16.09 45.7,14.94 IC5.13 45.61,14.94 v43.92,14.94
  Bottom 0.178: v43.92,14.94 33.34,4.36 33.34,3.91 16.98,3.91 12.71,8.18 12.71,44.09 JP1.3